# EAGLE schematic Sprite_Sail_1mx1m (EAGLE 9.0.0)
Assembly variants: hdmid
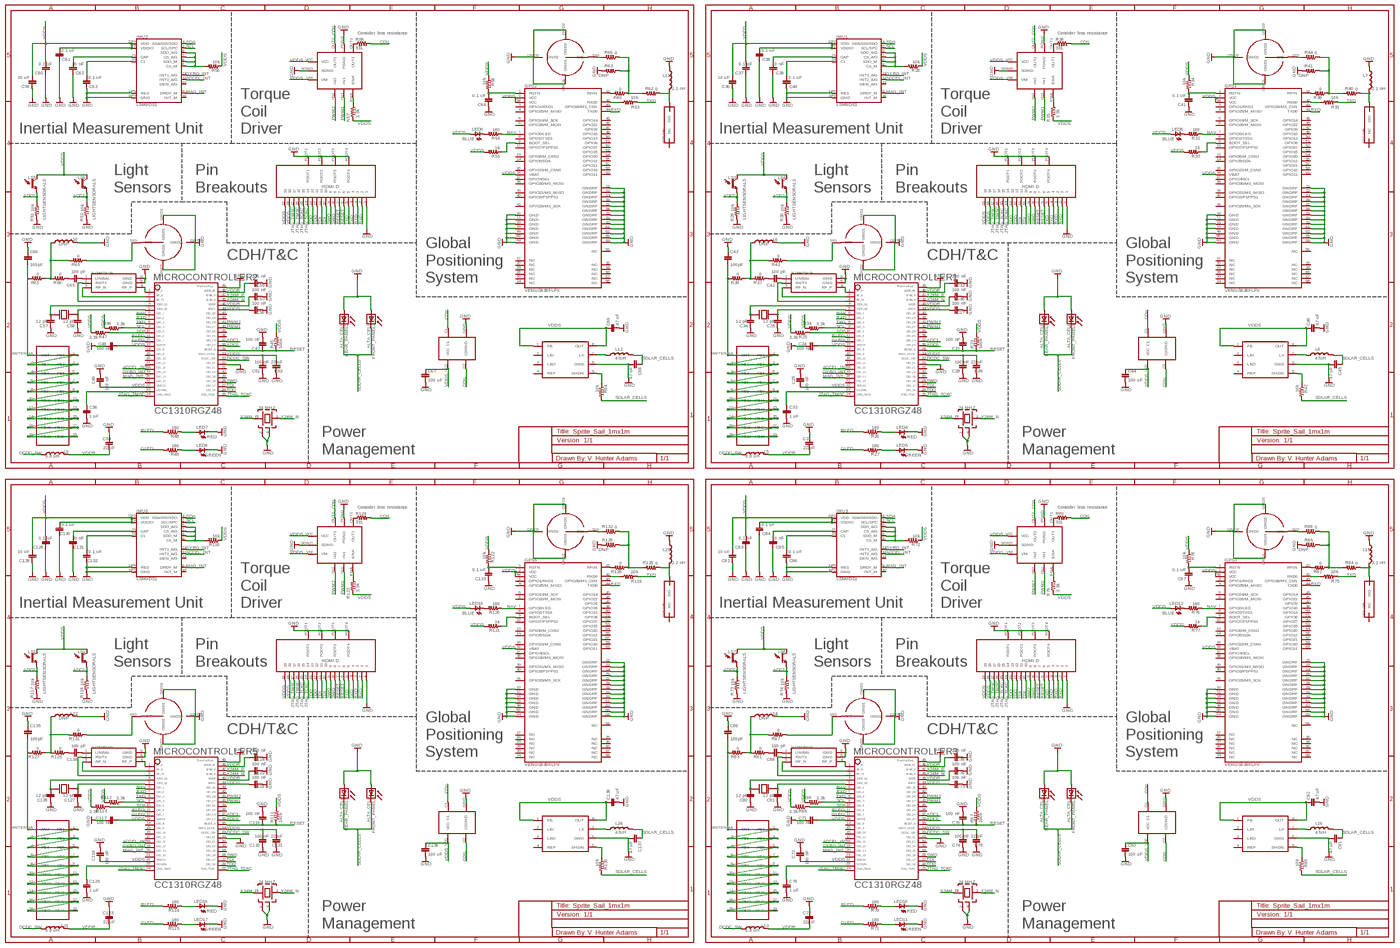
[diagram p0: schematic, sheet 1, overview]
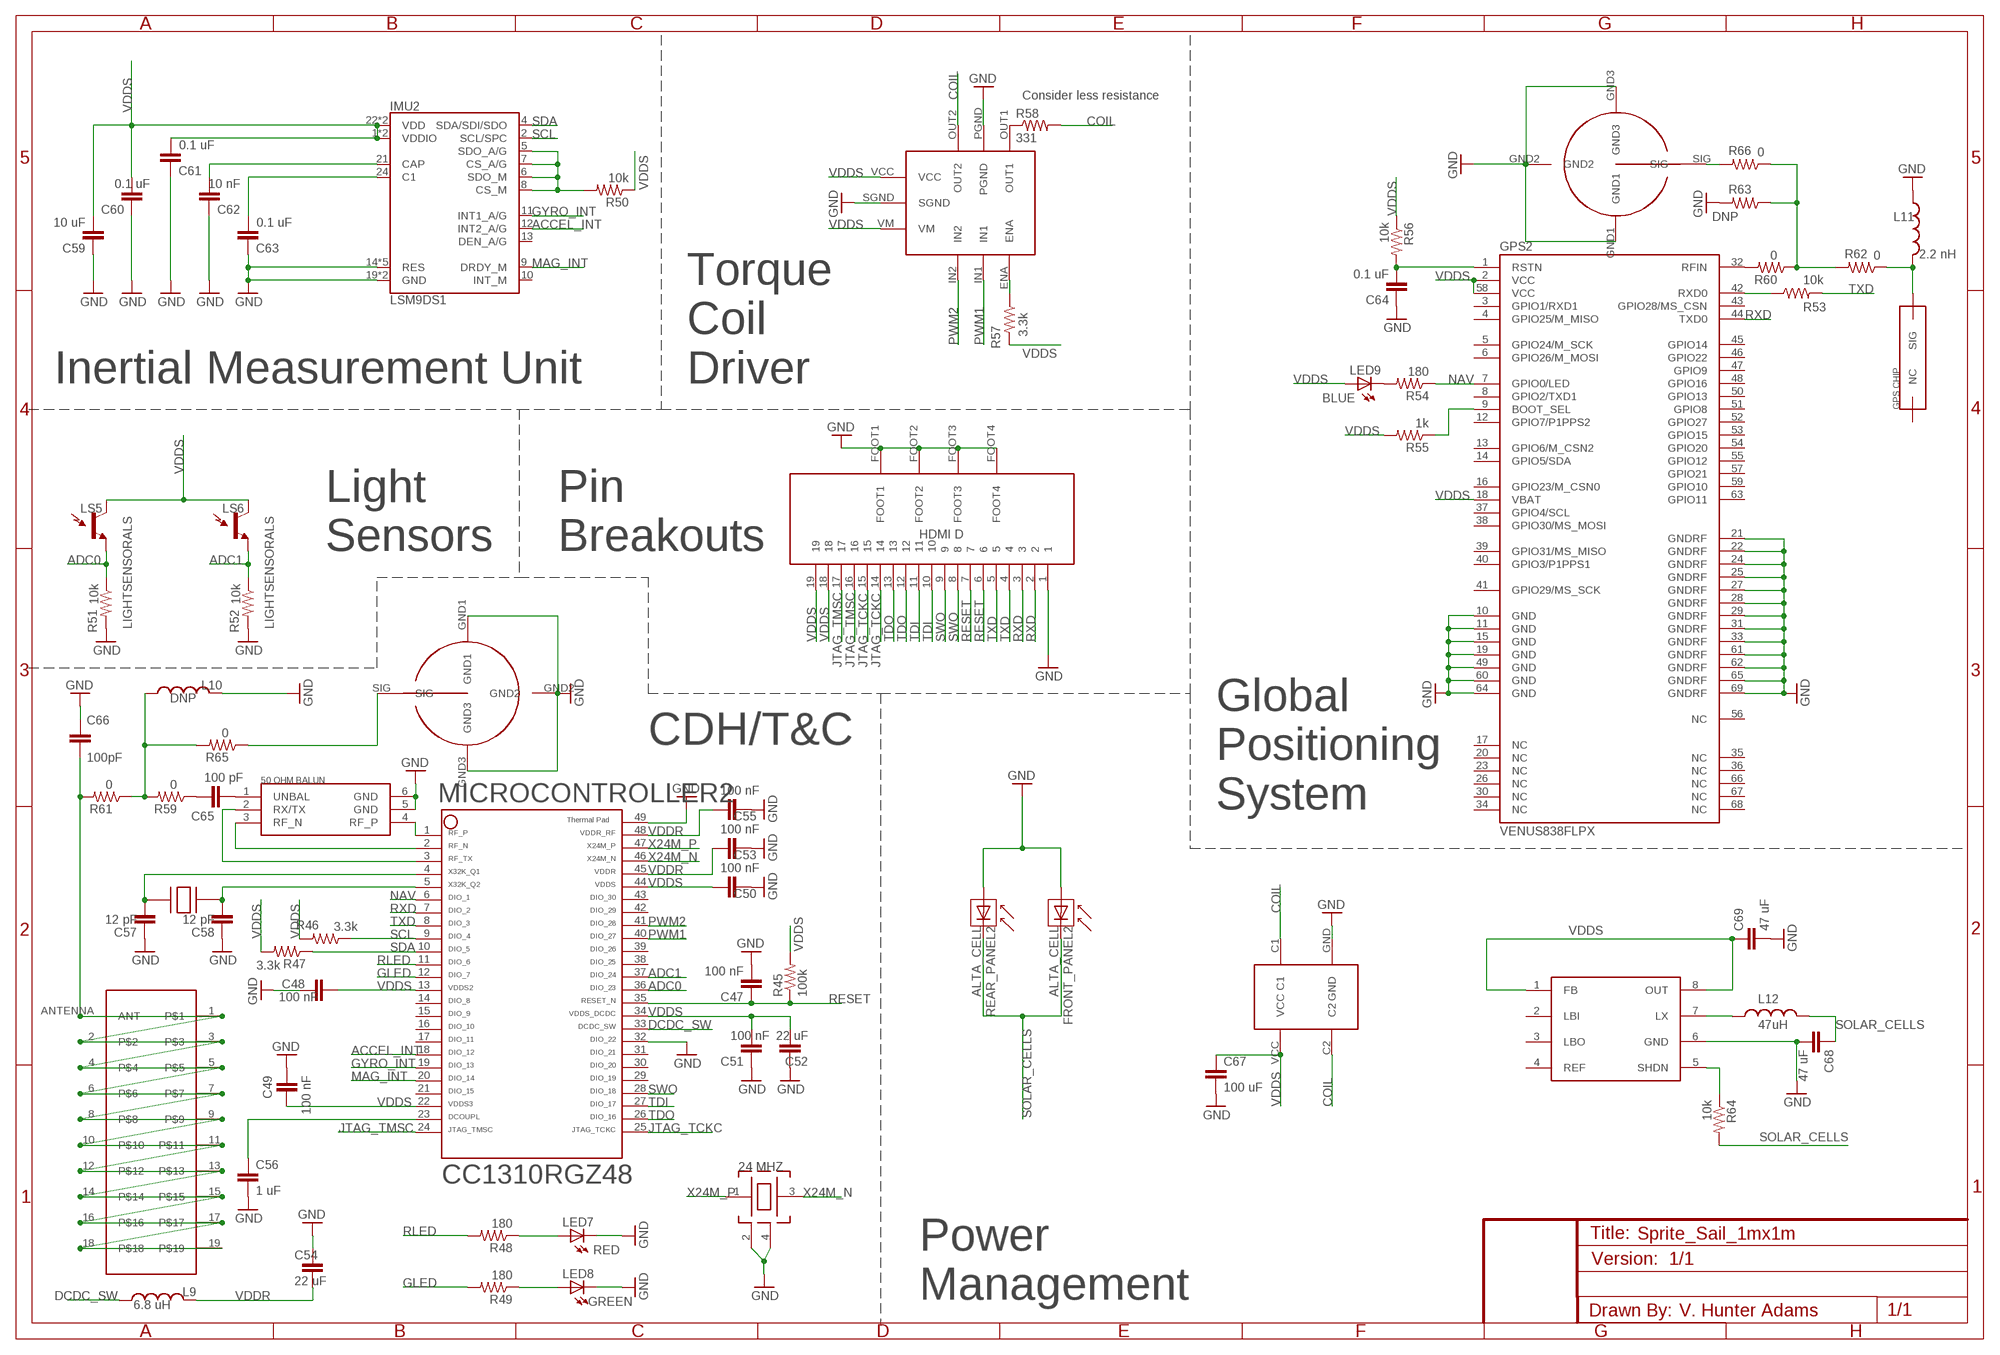
[diagram p1: schematic, sheet 1, part 1 of 4]
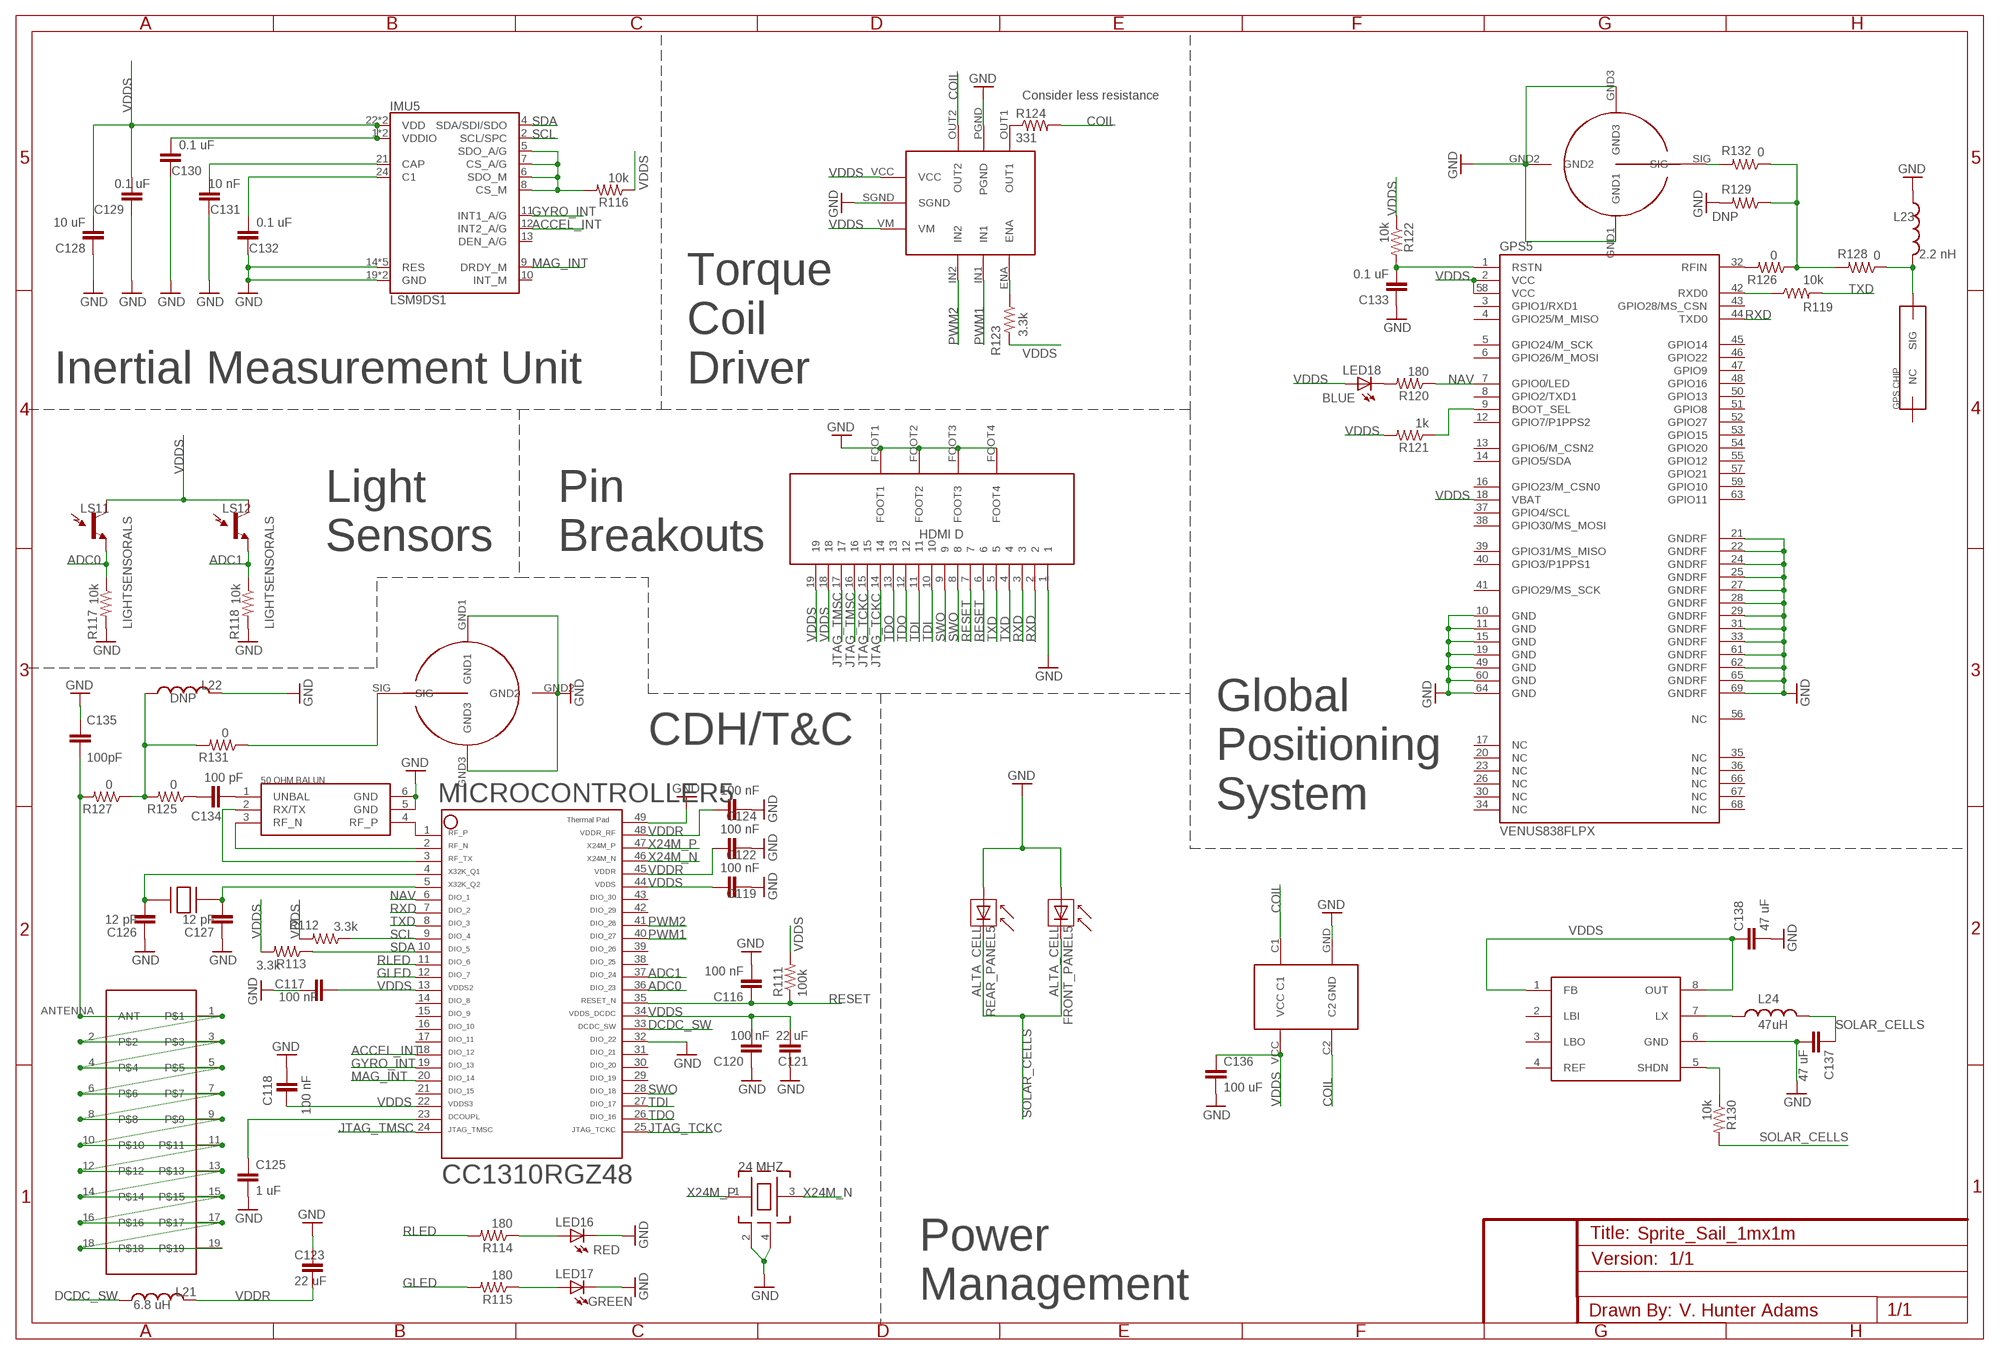
[diagram p2: schematic, sheet 1, part 2 of 4]
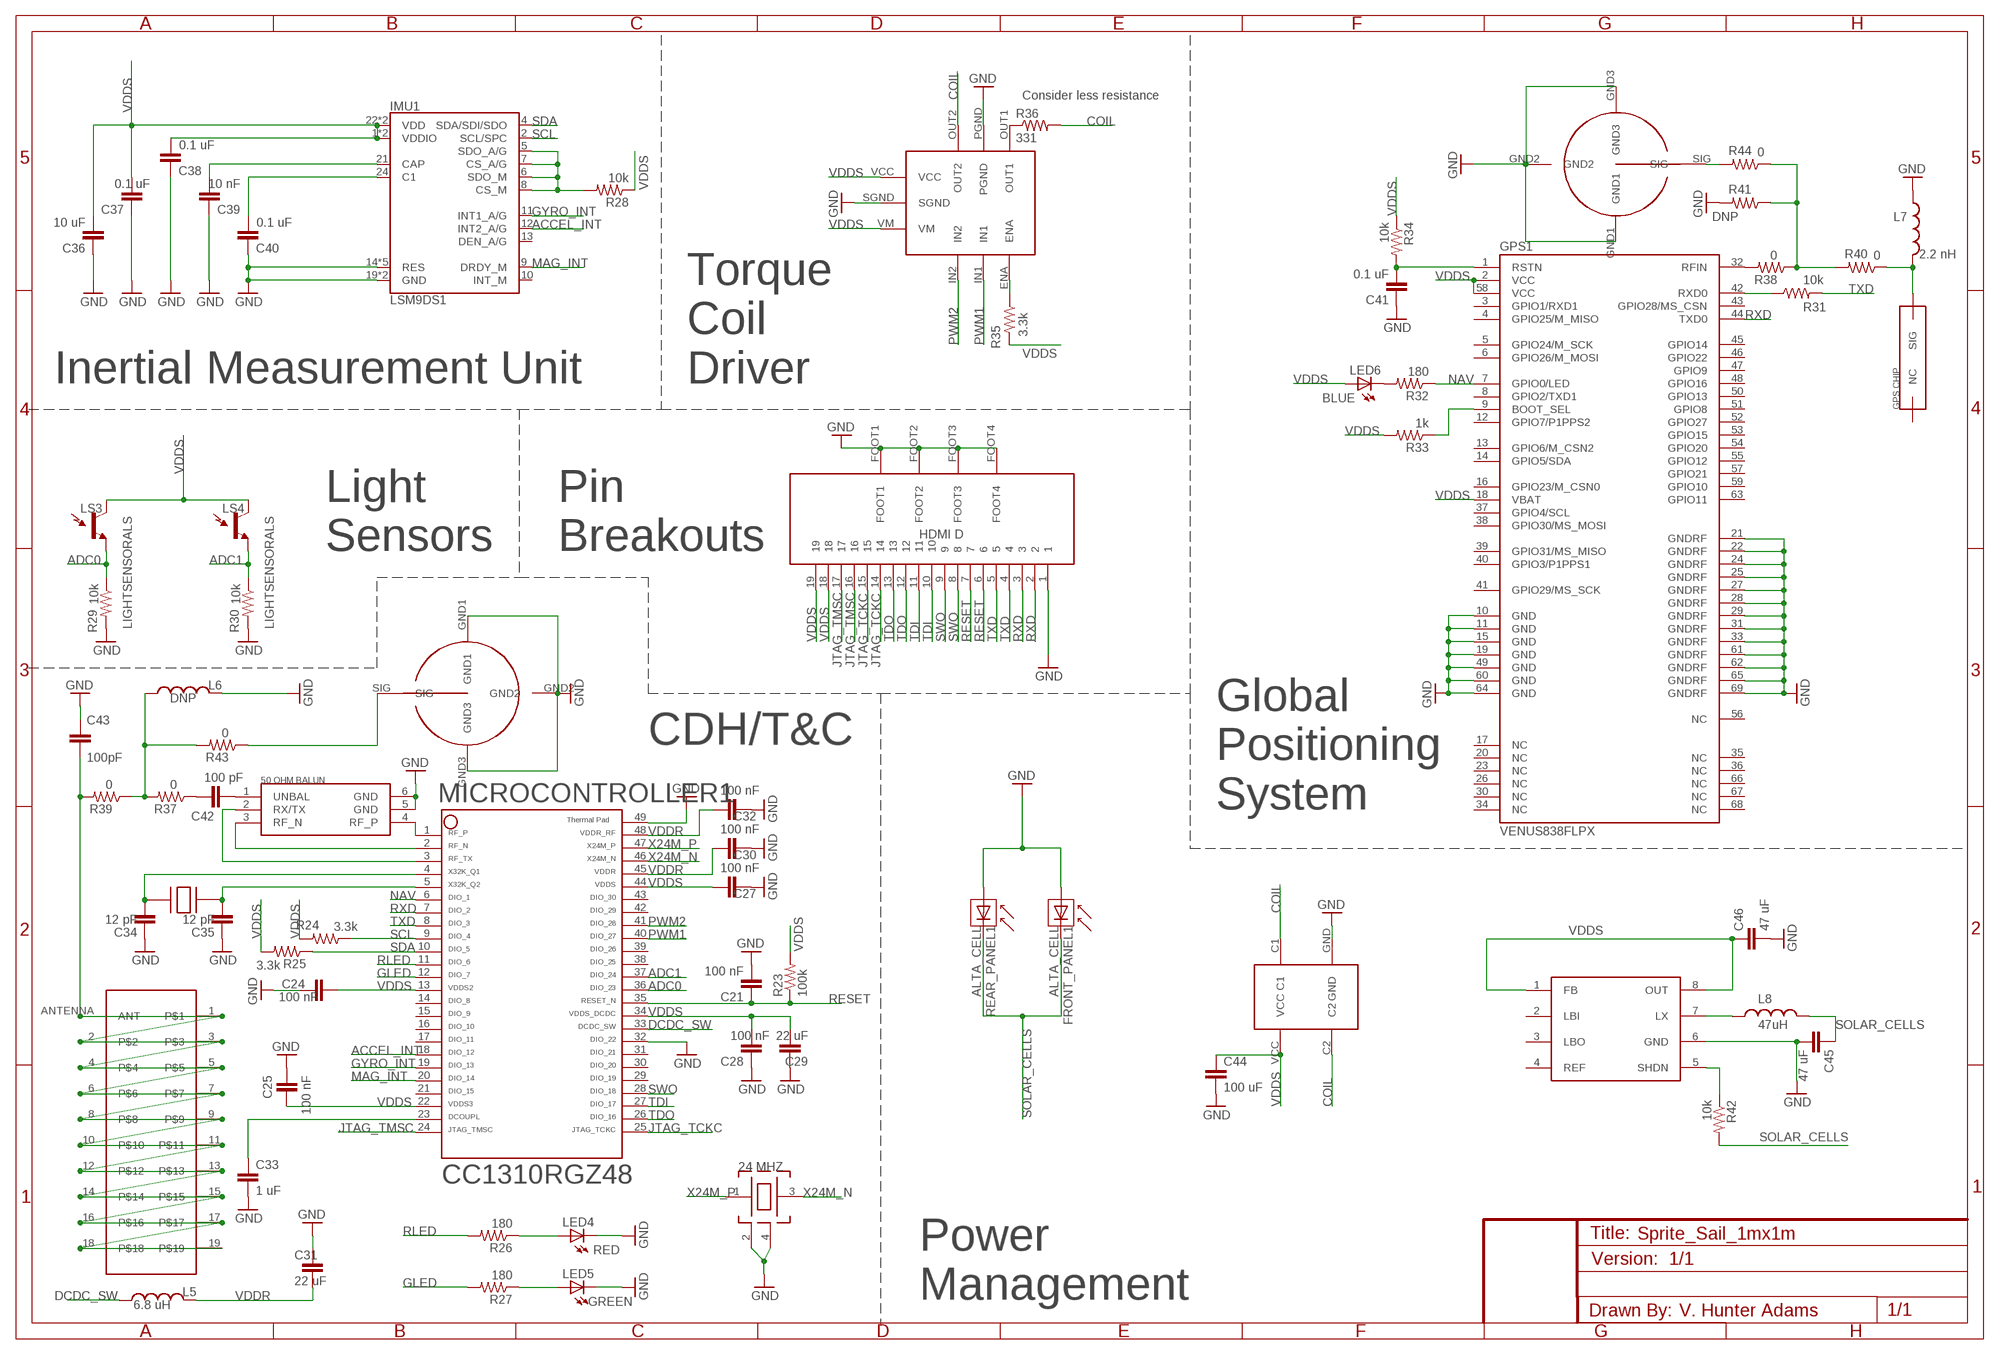
[diagram p3: schematic, sheet 1, part 3 of 4]
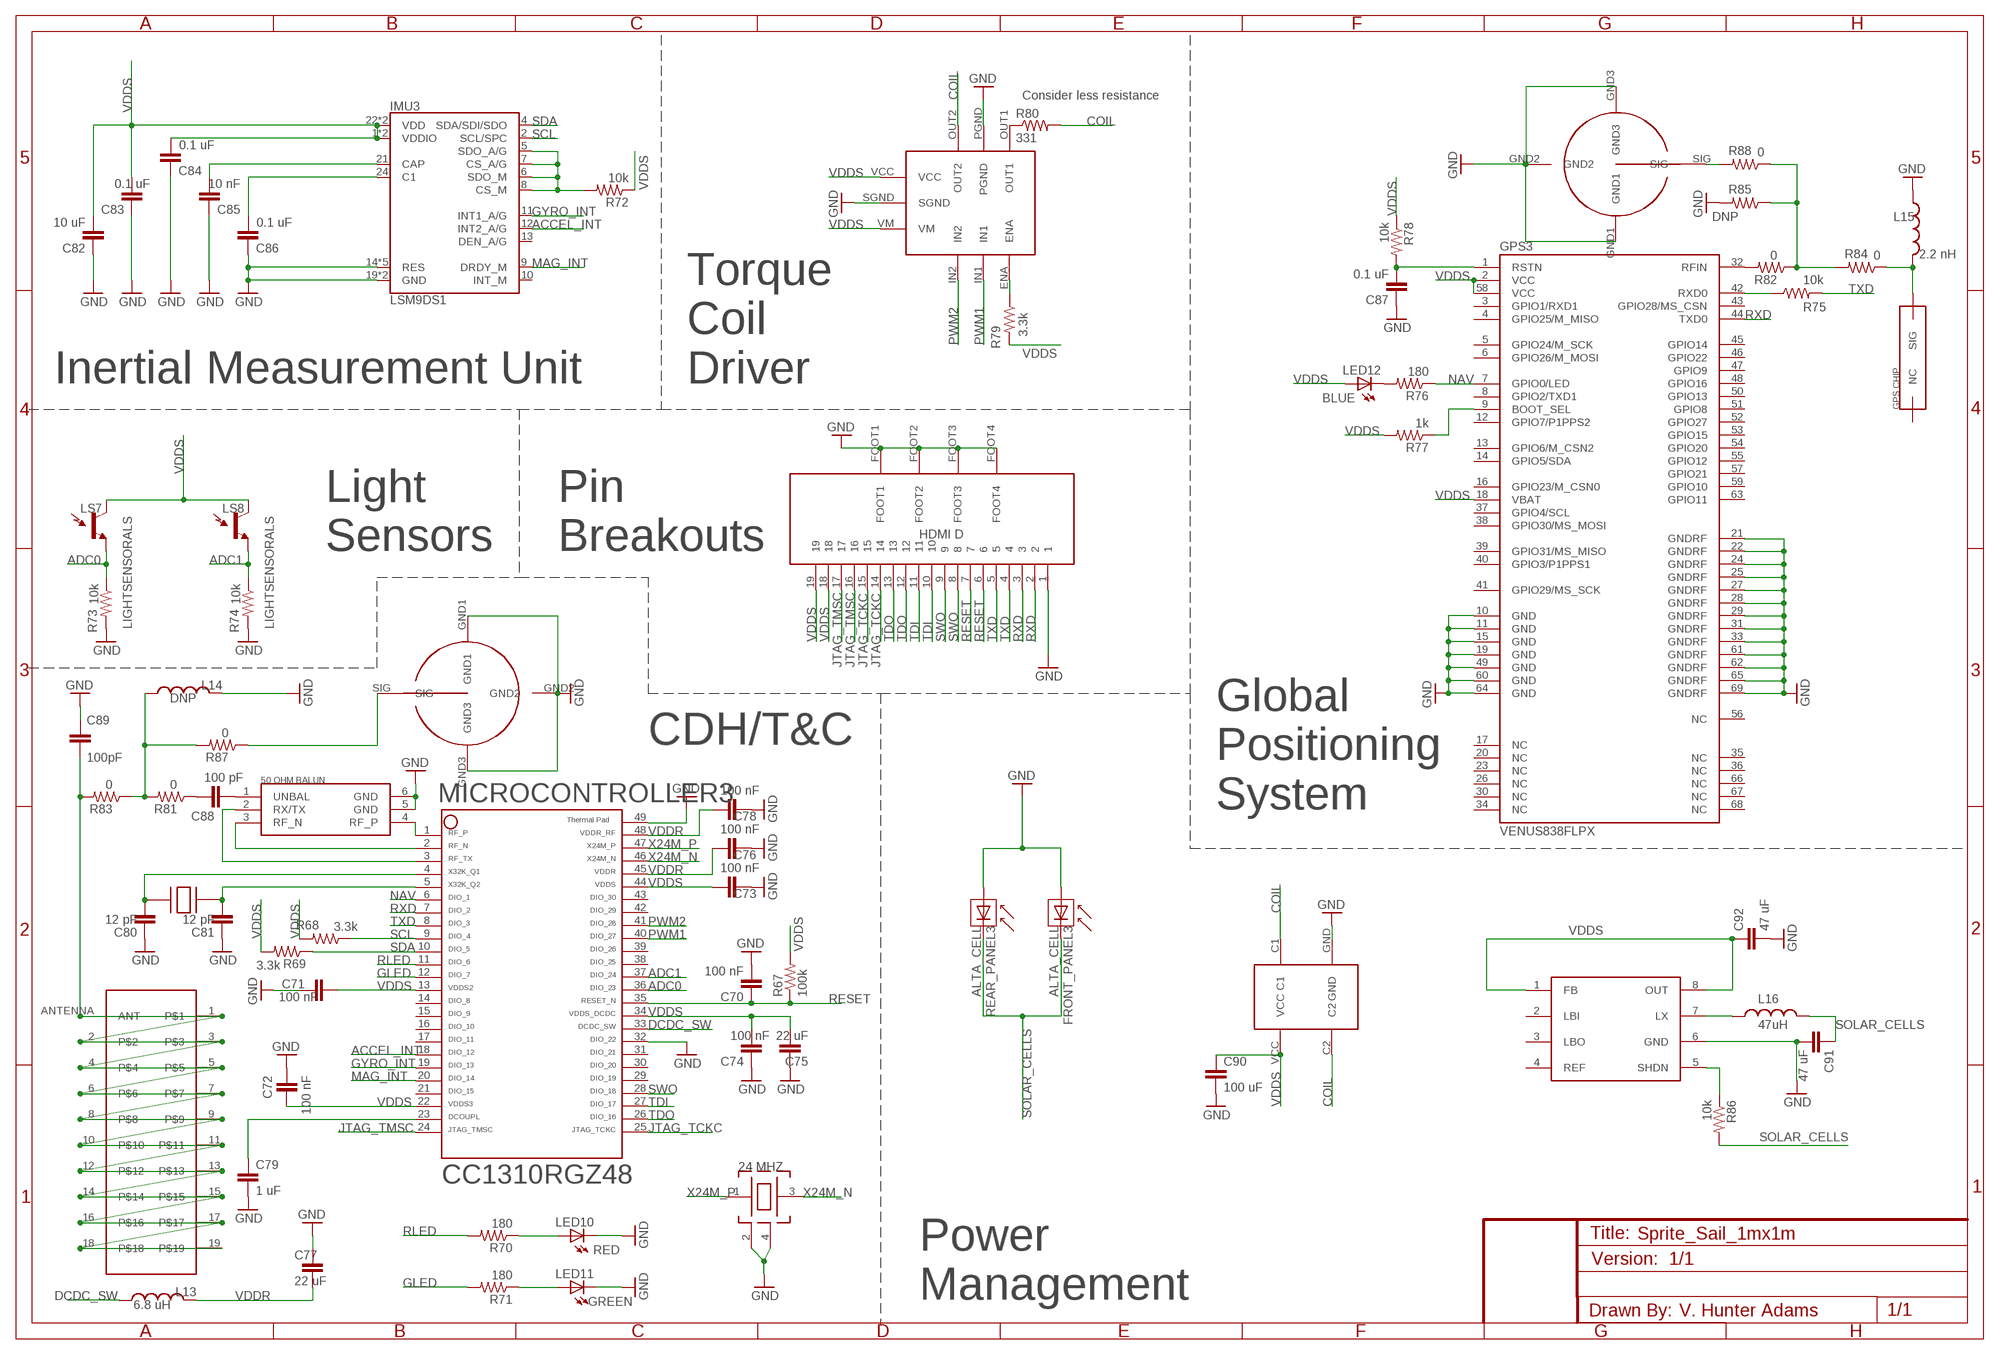
[diagram p4: schematic, sheet 1, part 4 of 4]

## Parts
32.1  FC-135  [FC-135]
32.2  FC-135  [FC-135]
32.3  FC-135  [FC-135]
32.5  FC-135  [FC-135]
BALUN1  JOHANSON_BALUN  [JOHANSON_BALUN]
BALUN2  JOHANSON_BALUN  [JOHANSON_BALUN]
BALUN3  JOHANSON_BALUN  [JOHANSON_BALUN]
BALUN5  JOHANSON_BALUN  [JOHANSON_BALUN]
C21  100 nF  CAP0402-CAP  [0402-CAP]
C24  100 nF  CAP0402-CAP  [0402-CAP]
C25  100 nF  CAP0402-CAP  [0402-CAP]
C27  100 nF  CAP0402-CAP  [0402-CAP]
C28  100 nF  CAP0402-CAP  [0402-CAP]
C29  22 uF  CAP0402-CAP  [0402-CAP]
C30  100 nF  CAP0402-CAP  [0402-CAP]
C31  22 uF  CAP0402-CAP  [0402-CAP]
C32  100 nF  CAP0402-CAP  [0402-CAP]
C33  1 uF  CAP0402-CAP  [0402-CAP]
C34  12 pF  CAP0402-CAP  [0402-CAP]
C35  12 pF  CAP0402-CAP  [0402-CAP]
C36  10 uF  CAP0402-CAP  [0402-CAP]
C37  0.1 uF  CAP0402-CAP  [0402-CAP]
C38  0.1 uF  CAP0402-CAP  [0402-CAP]
C39  10 nF  CAP0402-CAP  [0402-CAP]
C40  0.1 uF  CAP0402-CAP  [0402-CAP]
C41  0.1 uF  CAP0402-CAP  [0402-CAP]
C42  100 pF  CAP0402-CAP  [0402-CAP]
C43  100pF  CAP0603-CAP  [0603-CAP]
C44  100 uF  CAP0805  [0805]
C45  47 uF  CAP0805  [0805]
C46  47 uF  CAP0805  [0805]
C47  100 nF  CAP0402-CAP  [0402-CAP]
C48  100 nF  CAP0402-CAP  [0402-CAP]
C49  100 nF  CAP0402-CAP  [0402-CAP]
C50  100 nF  CAP0402-CAP  [0402-CAP]
C51  100 nF  CAP0402-CAP  [0402-CAP]
C52  22 uF  CAP0402-CAP  [0402-CAP]
C53  100 nF  CAP0402-CAP  [0402-CAP]
C54  22 uF  CAP0402-CAP  [0402-CAP]
C55  100 nF  CAP0402-CAP  [0402-CAP]
C56  1 uF  CAP0402-CAP  [0402-CAP]
C57  12 pF  CAP0402-CAP  [0402-CAP]
C58  12 pF  CAP0402-CAP  [0402-CAP]
C59  10 uF  CAP0402-CAP  [0402-CAP]
C60  0.1 uF  CAP0402-CAP  [0402-CAP]
C61  0.1 uF  CAP0402-CAP  [0402-CAP]
C62  10 nF  CAP0402-CAP  [0402-CAP]
C63  0.1 uF  CAP0402-CAP  [0402-CAP]
C64  0.1 uF  CAP0402-CAP  [0402-CAP]
C65  100 pF  CAP0402-CAP  [0402-CAP]
C66  100pF  CAP0603-CAP  [0603-CAP]
C67  100 uF  CAP0805  [0805]
C68  47 uF  CAP0805  [0805]
C69  47 uF  CAP0805  [0805]
C70  100 nF  CAP0402-CAP  [0402-CAP]
C71  100 nF  CAP0402-CAP  [0402-CAP]
C72  100 nF  CAP0402-CAP  [0402-CAP]
C73  100 nF  CAP0402-CAP  [0402-CAP]
C74  100 nF  CAP0402-CAP  [0402-CAP]
C75  22 uF  CAP0402-CAP  [0402-CAP]
C76  100 nF  CAP0402-CAP  [0402-CAP]
C77  22 uF  CAP0402-CAP  [0402-CAP]
C78  100 nF  CAP0402-CAP  [0402-CAP]
C79  1 uF  CAP0402-CAP  [0402-CAP]
C80  12 pF  CAP0402-CAP  [0402-CAP]
C81  12 pF  CAP0402-CAP  [0402-CAP]
C82  10 uF  CAP0402-CAP  [0402-CAP]
C83  0.1 uF  CAP0402-CAP  [0402-CAP]
C84  0.1 uF  CAP0402-CAP  [0402-CAP]
C85  10 nF  CAP0402-CAP  [0402-CAP]
C86  0.1 uF  CAP0402-CAP  [0402-CAP]
C87  0.1 uF  CAP0402-CAP  [0402-CAP]
C88  100 pF  CAP0402-CAP  [0402-CAP]
C89  100pF  CAP0603-CAP  [0603-CAP]
C90  100 uF  CAP0805  [0805]
C91  47 uF  CAP0805  [0805]
C92  47 uF  CAP0805  [0805]
C116  100 nF  CAP0402-CAP  [0402-CAP]
C117  100 nF  CAP0402-CAP  [0402-CAP]
C118  100 nF  CAP0402-CAP  [0402-CAP]
C119  100 nF  CAP0402-CAP  [0402-CAP]
C120  100 nF  CAP0402-CAP  [0402-CAP]
C121  22 uF  CAP0402-CAP  [0402-CAP]
C122  100 nF  CAP0402-CAP  [0402-CAP]
C123  22 uF  CAP0402-CAP  [0402-CAP]
C124  100 nF  CAP0402-CAP  [0402-CAP]
C125  1 uF  CAP0402-CAP  [0402-CAP]
C126  12 pF  CAP0402-CAP  [0402-CAP]
C127  12 pF  CAP0402-CAP  [0402-CAP]
C128  10 uF  CAP0402-CAP  [0402-CAP]
C129  0.1 uF  CAP0402-CAP  [0402-CAP]
C130  0.1 uF  CAP0402-CAP  [0402-CAP]
C131  10 nF  CAP0402-CAP  [0402-CAP]
C132  0.1 uF  CAP0402-CAP  [0402-CAP]
C133  0.1 uF  CAP0402-CAP  [0402-CAP]
C134  100 pF  CAP0402-CAP  [0402-CAP]
C135  100pF  CAP0603-CAP  [0603-CAP]
C136  100 uF  CAP0805  [0805]
C137  47 uF  CAP0805  [0805]
C138  47 uF  CAP0805  [0805]
FRONT_PANEL1  ALTA_CELL  [ALTA_CELL]
FRONT_PANEL2  ALTA_CELL  [ALTA_CELL]
FRONT_PANEL3  ALTA_CELL  [ALTA_CELL]
FRONT_PANEL5  ALTA_CELL  [ALTA_CELL]
GPS1  VENUS838FLPX  [VENUS838FLPX]
GPS2  VENUS838FLPX  [VENUS838FLPX]
GPS3  VENUS838FLPX  [VENUS838FLPX]
GPS5  VENUS838FLPX  [VENUS838FLPX]
IMU1  LSM9DS1  [LGA24-8X4]
IMU2  LSM9DS1  [LGA24-8X4]
IMU3  LSM9DS1  [LGA24-8X4]
IMU5  LSM9DS1  [LGA24-8X4]
L5  6.8 uH  INDUCTOR0603  [0603]
L6  DNP  INDUCTOR0603  [0603]
L7  2.2 nH  INDUCTOR0603  [0603]
L8  47uH  INDUCTOR0603  [0603]
L9  6.8 uH  INDUCTOR0603  [0603]
L10  DNP  INDUCTOR0603  [0603]
L11  2.2 nH  INDUCTOR0603  [0603]
L12  47uH  INDUCTOR0603  [0603]
L13  6.8 uH  INDUCTOR0603  [0603]
L14  DNP  INDUCTOR0603  [0603]
L15  2.2 nH  INDUCTOR0603  [0603]
L16  47uH  INDUCTOR0603  [0603]
L21  6.8 uH  INDUCTOR0603  [0603]
L22  DNP  INDUCTOR0603  [0603]
L23  2.2 nH  INDUCTOR0603  [0603]
L24  47uH  INDUCTOR0603  [0603]
LED4  RED  LED0603  [LED-0603]
LED5  GREEN  LED0603  [LED-0603]
LED6  BLUE  LED0603  [LED-0603]
LED7  RED  LED0603  [LED-0603]
LED8  GREEN  LED0603  [LED-0603]
LED9  BLUE  LED0603  [LED-0603]
LED10  RED  LED0603  [LED-0603]
LED11  GREEN  LED0603  [LED-0603]
LED12  BLUE  LED0603  [LED-0603]
LED16  RED  LED0603  [LED-0603]
LED17  GREEN  LED0603  [LED-0603]
LED18  BLUE  LED0603  [LED-0603]
LS3  LIGHTSENSORALS  [ALS-PT19]
LS4  LIGHTSENSORALS  [ALS-PT19]
LS5  LIGHTSENSORALS  [ALS-PT19]
LS6  LIGHTSENSORALS  [ALS-PT19]
LS7  LIGHTSENSORALS  [ALS-PT19]
LS8  LIGHTSENSORALS  [ALS-PT19]
LS11  LIGHTSENSORALS  [ALS-PT19]
LS12  LIGHTSENSORALS  [ALS-PT19]
MICROCONTROLLER1  CC1310  [CC1310]
MICROCONTROLLER2  CC1310  [CC1310]
MICROCONTROLLER3  CC1310  [CC1310]
MICROCONTROLLER5  CC1310  [CC1310]
R23  100k  RESISTOR0402-RES  [0402-RES]
R24  3.3k  RESISTOR0402-RES  [0402-RES]
R25  3.3k  RESISTOR0402-RES  [0402-RES]
R26  180  RESISTOR0402-RES  [0402-RES]
R27  180  RESISTOR0402-RES  [0402-RES]
R28  10k  RESISTOR0402-RES  [0402-RES]
R29  10k  RESISTOR0402-RES  [0402-RES]
R30  10k  RESISTOR0402-RES  [0402-RES]
R31  10k  RESISTOR0402-RES  [0402-RES]
R32  180  RESISTOR0402-RES  [0402-RES]
R33  1k  RESISTOR0402-RES  [0402-RES]
R34  10k  RESISTOR0402-RES  [0402-RES]
R35  3.3k  RESISTOR0402-RES  [0402-RES]
R36  331  RESISTOR0402-RES  [0402-RES]
R37  0  RESISTOR0603-RES  [0603-RES]
R38  0  RESISTOR0603-RES  [0603-RES]
R39  0  RESISTOR0603-RES  [0603-RES]
R40  0  RESISTOR0603-RES  [0603-RES]
R41  DNP  RESISTOR0603-RES  [0603-RES]
R42  10k  RESISTOR0402-RES  [0402-RES]
R43  0  RESISTOR0603-RES  [0603-RES]
R44  0  RESISTOR0603-RES  [0603-RES]
R45  100k  RESISTOR0402-RES  [0402-RES]
R46  3.3k  RESISTOR0402-RES  [0402-RES]
R47  3.3k  RESISTOR0402-RES  [0402-RES]
R48  180  RESISTOR0402-RES  [0402-RES]
R49  180  RESISTOR0402-RES  [0402-RES]
R50  10k  RESISTOR0402-RES  [0402-RES]
R51  10k  RESISTOR0402-RES  [0402-RES]
R52  10k  RESISTOR0402-RES  [0402-RES]
R53  10k  RESISTOR0402-RES  [0402-RES]
R54  180  RESISTOR0402-RES  [0402-RES]
R55  1k  RESISTOR0402-RES  [0402-RES]
R56  10k  RESISTOR0402-RES  [0402-RES]
R57  3.3k  RESISTOR0402-RES  [0402-RES]
R58  331  RESISTOR0402-RES  [0402-RES]
R59  0  RESISTOR0603-RES  [0603-RES]
R60  0  RESISTOR0603-RES  [0603-RES]
R61  0  RESISTOR0603-RES  [0603-RES]
R62  0  RESISTOR0603-RES  [0603-RES]
R63  DNP  RESISTOR0603-RES  [0603-RES]
R64  10k  RESISTOR0402-RES  [0402-RES]
R65  0  RESISTOR0603-RES  [0603-RES]
R66  0  RESISTOR0603-RES  [0603-RES]
R67  100k  RESISTOR0402-RES  [0402-RES]
R68  3.3k  RESISTOR0402-RES  [0402-RES]
R69  3.3k  RESISTOR0402-RES  [0402-RES]
R70  180  RESISTOR0402-RES  [0402-RES]
R71  180  RESISTOR0402-RES  [0402-RES]
R72  10k  RESISTOR0402-RES  [0402-RES]
R73  10k  RESISTOR0402-RES  [0402-RES]
R74  10k  RESISTOR0402-RES  [0402-RES]
R75  10k  RESISTOR0402-RES  [0402-RES]
R76  180  RESISTOR0402-RES  [0402-RES]
R77  1k  RESISTOR0402-RES  [0402-RES]
R78  10k  RESISTOR0402-RES  [0402-RES]
R79  3.3k  RESISTOR0402-RES  [0402-RES]
R80  331  RESISTOR0402-RES  [0402-RES]
R81  0  RESISTOR0603-RES  [0603-RES]
R82  0  RESISTOR0603-RES  [0603-RES]
R83  0  RESISTOR0603-RES  [0603-RES]
R84  0  RESISTOR0603-RES  [0603-RES]
R85  DNP  RESISTOR0603-RES  [0603-RES]
R86  10k  RESISTOR0402-RES  [0402-RES]
R87  0  RESISTOR0603-RES  [0603-RES]
R88  0  RESISTOR0603-RES  [0603-RES]
R111  100k  RESISTOR0402-RES  [0402-RES]
R112  3.3k  RESISTOR0402-RES  [0402-RES]
R113  3.3k  RESISTOR0402-RES  [0402-RES]
R114  180  RESISTOR0402-RES  [0402-RES]
R115  180  RESISTOR0402-RES  [0402-RES]
R116  10k  RESISTOR0402-RES  [0402-RES]
R117  10k  RESISTOR0402-RES  [0402-RES]
R118  10k  RESISTOR0402-RES  [0402-RES]
R119  10k  RESISTOR0402-RES  [0402-RES]
R120  180  RESISTOR0402-RES  [0402-RES]
R121  1k  RESISTOR0402-RES  [0402-RES]
R122  10k  RESISTOR0402-RES  [0402-RES]
R123  3.3k  RESISTOR0402-RES  [0402-RES]
R124  331  RESISTOR0402-RES  [0402-RES]
R125  0  RESISTOR0603-RES  [0603-RES]
R126  0  RESISTOR0603-RES  [0603-RES]
R127  0  RESISTOR0603-RES  [0603-RES]
R128  0  RESISTOR0603-RES  [0603-RES]
R129  DNP  RESISTOR0603-RES  [0603-RES]
R130  10k  RESISTOR0402-RES  [0402-RES]
R131  0  RESISTOR0603-RES  [0603-RES]
R132  0  RESISTOR0603-RES  [0603-RES]
REAR_PANEL1  ALTA_CELL  [ALTA_CELL]
REAR_PANEL2  ALTA_CELL  [ALTA_CELL]
REAR_PANEL3  ALTA_CELL  [ALTA_CELL]
REAR_PANEL5  ALTA_CELL  [ALTA_CELL]
TSX1  TSX-3225  [TSX-3225]
TSX2  TSX-3225  [TSX-3225]
TSX3  TSX-3225  [TSX-3225]
TSX5  TSX-3225  [TSX-3225]
U$1  LV8417CS  [LV8417CS]
U$10  JOHANSON_GPS_CHIP  [JOHANSON_GPS_CHIP]
U$11  PANASONIC_RECTIFIER  [PANASONIC_RECTIFIER]
U$12  PCB_ANTENNA  [PCB_ANTENNA]
U$13  MM5329-2700  [MM5829-2700]
U$14  MM5329-2700  [MM5829-2700]
U$15  L6920  [L6920]
U$16  HDMID  [HDMID]
U$17  LV8417CS  [LV8417CS]
U$18  JOHANSON_GPS_CHIP  [JOHANSON_GPS_CHIP]
U$19  PANASONIC_RECTIFIER  [PANASONIC_RECTIFIER]
U$20  PCB_ANTENNA  [PCB_ANTENNA]
U$21  MM5329-2700  [MM5829-2700]
U$22  MM5329-2700  [MM5829-2700]
U$23  L6920  [L6920]
U$24  HDMID  [HDMID]
U$25  LV8417CS  [LV8417CS]
U$26  JOHANSON_GPS_CHIP  [JOHANSON_GPS_CHIP]
U$27  PANASONIC_RECTIFIER  [PANASONIC_RECTIFIER]
U$28  PCB_ANTENNA  [PCB_ANTENNA]
U$29  MM5329-2700  [MM5829-2700]
U$30  MM5329-2700  [MM5829-2700]
U$31  L6920  [L6920]
U$32  HDMID  [HDMID]
U$41  LV8417CS  [LV8417CS]
U$42  JOHANSON_GPS_CHIP  [JOHANSON_GPS_CHIP]
U$43  PANASONIC_RECTIFIER  [PANASONIC_RECTIFIER]
U$44  PCB_ANTENNA  [PCB_ANTENNA]
U$45  MM5329-2700  [MM5829-2700]
U$46  MM5329-2700  [MM5829-2700]
U$47  L6920  [L6920]
U$48  HDMID  [HDMID]

## Nets
ACCEL_INT: IMU1.12(INT2_A/G) IMU2.12(INT2_A/G) IMU3.12(INT2_A/G) IMU5.12(INT2_A/G) MICROCONTROLLER1.18 MICROCONTROLLER2.18 MICROCONTROLLER3.18 MICROCONTROLLER5.18
ADC0: LS3.E(E1) LS5.E(E1) LS7.E(E1) LS11.E(E1) MICROCONTROLLER1.36 MICROCONTROLLER2.36 MICROCONTROLLER3.36 MICROCONTROLLER5.36 R29.1 R51.1 R73.1 R117.1
ADC1: LS4.E(E1) LS6.E(E1) LS8.E(E1) LS12.E(E1) MICROCONTROLLER1.37 MICROCONTROLLER2.37 MICROCONTROLLER3.37 MICROCONTROLLER5.37 R30.1 R52.1 R74.1 R118.1
ANTENNA1: C43.2 R39.2 U$12.1 U$12.2 U$12.3 U$12.4 U$12.5 U$12.6 U$12.7 U$12.8 U$12.9 U$12.10 U$12.11 U$12.12 U$12.13 U$12.14 U$12.15 U$12.16 U$12.17 U$12.18 U$12.19 U$12.ANTENNA(ANT)
ANTENNA2: C66.2 R61.2 U$20.1 U$20.2 U$20.3 U$20.4 U$20.5 U$20.6 U$20.7 U$20.8 U$20.9 U$20.10 U$20.11 U$20.12 U$20.13 U$20.14 U$20.15 U$20.16 U$20.17 U$20.18 U$20.19 U$20.ANTENNA(ANT)
ANTENNA3: C89.2 R83.2 U$28.1 U$28.2 U$28.3 U$28.4 U$28.5 U$28.6 U$28.7 U$28.8 U$28.9 U$28.10 U$28.11 U$28.12 U$28.13 U$28.14 U$28.15 U$28.16 U$28.17 U$28.18 U$28.19 U$28.ANTENNA(ANT)
ANTENNA5: C135.2 R127.2 U$44.1 U$44.2 U$44.3 U$44.4 U$44.5 U$44.6 U$44.7 U$44.8 U$44.9 U$44.10 U$44.11 U$44.12 U$44.13 U$44.14 U$44.15 U$44.16 U$44.17 U$44.18 U$44.19 U$44.ANTENNA(ANT)
COIL: R36.2 R58.2 R80.2 R124.2 U$1.OUT2 U$11.C1 U$11.C2 U$17.OUT2 U$19.C1 U$19.C2 U$25.OUT2 U$27.C1 U$27.C2 U$41.OUT2 U$43.C1 U$43.C2
DCDC_SW: L5.1 L9.1 L13.1 L21.1 MICROCONTROLLER1.33 MICROCONTROLLER2.33 MICROCONTROLLER3.33 MICROCONTROLLER5.33
GLED: MICROCONTROLLER1.12 MICROCONTROLLER2.12 MICROCONTROLLER3.12 MICROCONTROLLER5.12 R27.2 R49.2 R71.2 R115.2
GND: BALUN1.5(GND) BALUN1.6(GND) BALUN2.5(GND) BALUN2.6(GND) BALUN3.5(GND) BALUN3.6(GND) BALUN5.5(GND) BALUN5.6(GND) C21.2 C24.2 C25.2 C27.2 C28.2 C29.2 C30.2 C31.2 C32.2 C33.2 C34.2 C35.2 C36.2 C37.2 C38.2 C39.2 C40.2 C41.2 C43.1 C44.2 C45.2 C46.2 C47.2 C48.2 C49.2 C50.2 C51.2 C52.2 C53.2 C54.2 C55.2 C56.2 C57.2 C58.2 C59.2 C60.2 C61.2 C62.2 C63.2 C64.2 C66.1 C67.2 C68.2 C69.2 C70.2 C71.2 C72.2 C73.2 C74.2 C75.2 C76.2 C77.2 C78.2 C79.2 C80.2 C81.2 C82.2 C83.2 C84.2 C85.2 C86.2 C87.2 C89.1 C90.2 C91.2 C92.2 C116.2 C117.2 C118.2 C119.2 C120.2 C121.2 C122.2 C123.2 C124.2 C125.2 C126.2 C127.2 C128.2 C129.2 C130.2 C131.2 C132.2 C133.2 C135.1 C136.2 C137.2 C138.2 FRONT_PANEL1.- FRONT_PANEL2.- FRONT_PANEL3.- FRONT_PANEL5.- GPS1.10(GND) GPS1.11(GND) GPS1.15(GND) GPS1.19(GND) GPS1.21(GNDRF) GPS1.22(GNDRF) GPS1.24(GNDRF) GPS1.25(GNDRF) GPS1.27(GNDRF) GPS1.28(GNDRF) GPS1.29(GNDRF) GPS1.31(GNDRF) GPS1.33(GNDRF) GPS1.49(GND) GPS1.60(GND) GPS1.61(GNDRF) GPS1.62(GNDRF) GPS1.64(GND) GPS1.65(GNDRF) GPS1.69(GNDRF) GPS2.10(GND) GPS2.11(GND) GPS2.15(GND) GPS2.19(GND) GPS2.21(GNDRF) GPS2.22(GNDRF) GPS2.24(GNDRF) GPS2.25(GNDRF) GPS2.27(GNDRF) GPS2.28(GNDRF) GPS2.29(GNDRF) GPS2.31(GNDRF) GPS2.33(GNDRF) GPS2.49(GND) GPS2.60(GND) GPS2.61(GNDRF) GPS2.62(GNDRF) GPS2.64(GND) GPS2.65(GNDRF) GPS2.69(GNDRF) GPS3.10(GND) GPS3.11(GND) GPS3.15(GND) GPS3.19(GND) GPS3.21(GNDRF) GPS3.22(GNDRF) GPS3.24(GNDRF) GPS3.25(GNDRF) GPS3.27(GNDRF) GPS3.28(GNDRF) GPS3.29(GNDRF) GPS3.31(GNDRF) GPS3.33(GNDRF) GPS3.49(GND) GPS3.60(GND) GPS3.61(GNDRF) GPS3.62(GNDRF) GPS3.64(GND) GPS3.65(GNDRF) GPS3.69(GNDRF) GPS5.10(GND) GPS5.11(GND) GPS5.15(GND) GPS5.19(GND) GPS5.21(GNDRF) GPS5.22(GNDRF) GPS5.24(GNDRF) GPS5.25(GNDRF) GPS5.27(GNDRF) GPS5.28(GNDRF) GPS5.29(GNDRF) GPS5.31(GNDRF) GPS5.33(GNDRF) GPS5.49(GND) GPS5.60(GND) GPS5.61(GNDRF) GPS5.62(GNDRF) GPS5.64(GND) GPS5.65(GNDRF) GPS5.69(GNDRF) IMU1.14(RES) IMU1.15(RES) IMU1.16(RES) IMU1.17(RES) IMU1.18(RES) IMU1.19(GND) IMU1.20(GND) IMU2.14(RES) IMU2.15(RES) IMU2.16(RES) IMU2.17(RES) IMU2.18(RES) IMU2.19(GND) IMU2.20(GND) IMU3.14(RES) IMU3.15(RES) IMU3.16(RES) IMU3.17(RES) IMU3.18(RES) IMU3.19(GND) IMU3.20(GND) IMU5.14(RES) IMU5.15(RES) IMU5.16(RES) IMU5.17(RES) IMU5.18(RES) IMU5.19(GND) IMU5.20(GND) L6.2 L7.1 L10.2 L11.1 L14.2 L15.1 L22.2 L23.1 LED4.C LED5.C LED7.C LED8.C LED10.C LED11.C LED16.C LED17.C MICROCONTROLLER1.32 MICROCONTROLLER1.49 MICROCONTROLLER2.32 MICROCONTROLLER2.49 MICROCONTROLLER3.32 MICROCONTROLLER3.49 MICROCONTROLLER5.32 MICROCONTROLLER5.49 R29.2 R30.2 R41.2 R51.2 R52.2 R63.2 R73.2 R74.2 R85.2 R117.2 R118.2 R129.2 REAR_PANEL1.- REAR_PANEL2.- REAR_PANEL3.- REAR_PANEL5.- TSX1.2 TSX1.4 TSX2.2 TSX2.4 TSX3.2 TSX3.4 TSX5.2 TSX5.4 U$1.PGND U$1.SGND U$11.GND U$13.GND1 U$13.GND2 U$13.GND3 U$14.GND1 U$14.GND2 U$14.GND3 U$15.6(GND) U$16.1 U$16.FOOT1 U$16.FOOT2 U$16.FOOT3 U$16.FOOT4 U$17.PGND U$17.SGND U$19.GND U$21.GND1 U$21.GND2 U$21.GND3 U$22.GND1 U$22.GND2 U$22.GND3 U$23.6(GND) U$24.1 U$24.FOOT1 U$24.FOOT2 U$24.FOOT3 U$24.FOOT4 U$25.PGND U$25.SGND U$27.GND U$29.GND1 U$29.GND2 U$29.GND3 U$30.GND1 U$30.GND2 U$30.GND3 U$31.6(GND) U$32.1 U$32.FOOT1 U$32.FOOT2 U$32.FOOT3 U$32.FOOT4 U$41.PGND U$41.SGND U$43.GND U$45.GND1 U$45.GND2 U$45.GND3 U$46.GND1 U$46.GND2 U$46.GND3 U$47.6(GND) U$48.1 U$48.FOOT1 U$48.FOOT2 U$48.FOOT3 U$48.FOOT4
GYRO_INT: IMU1.11(INT1_A/G) IMU2.11(INT1_A/G) IMU3.11(INT1_A/G) IMU5.11(INT1_A/G) MICROCONTROLLER1.19 MICROCONTROLLER2.19 MICROCONTROLLER3.19 MICROCONTROLLER5.19
JTAG_TCKC: MICROCONTROLLER1.25 MICROCONTROLLER2.25 MICROCONTROLLER3.25 MICROCONTROLLER5.25 U$16.14 U$16.15 U$24.14 U$24.15 U$32.14 U$32.15 U$48.14 U$48.15
JTAG_TMSC: MICROCONTROLLER1.24 MICROCONTROLLER2.24 MICROCONTROLLER3.24 MICROCONTROLLER5.24 U$16.16 U$16.17 U$24.16 U$24.17 U$32.16 U$32.17 U$48.16 U$48.17
MAG_INT: IMU1.9(DRDY_M) IMU2.9(DRDY_M) IMU3.9(DRDY_M) IMU5.9(DRDY_M) MICROCONTROLLER1.20 MICROCONTROLLER2.20 MICROCONTROLLER3.20 MICROCONTROLLER5.20
N$49: C33.1 MICROCONTROLLER1.23
N$50: 32.1.P2 C34.1 MICROCONTROLLER1.4
N$51: 32.1.P1 C35.1 MICROCONTROLLER1.5
N$52: LED4.A R26.1
N$53: LED5.A R27.1
N$54: C39.1 IMU1.21(CAP)
N$55: C40.1 IMU1.24(C1)
N$56: IMU1.5(SDO_A/G) IMU1.6(SDO_M) IMU1.7(CS_A/G) IMU1.8(CS_M) R28.2
N$57: GPS1.42(RXD0) R31.1
N$58: LED6.C R32.2
N$59: GPS1.9(BOOT_SEL) R33.1
N$60: C41.1 GPS1.1(RSTN) R34.2
N$61: R35.1 U$1.ENA
N$62: R36.1 U$1.OUT1
N$63: BALUN1.4(RF_P) MICROCONTROLLER1.1
N$64: BALUN1.3(RF_N) MICROCONTROLLER1.2
N$65: BALUN1.2(RX/TX) MICROCONTROLLER1.3
N$66: BALUN1.1(UNBAL) C42.2
N$67: L6.1 R37.2 R39.1 R43.2
N$68: C42.1 R37.1
N$69: GPS1.32(RFIN) R38.2
N$70: R38.1 R40.2 R41.1 R44.1
N$71: L7.2 R40.1 U$10.SIG
N$72: R42.1 U$15.5(SHDN)
N$73: L8.1 U$15.7(LX)
N$74: R44.2 U$14.SIG
N$75: R43.1 U$13.SIG
N$97: C56.1 MICROCONTROLLER2.23
N$98: 32.2.P2 C57.1 MICROCONTROLLER2.4
N$99: 32.2.P1 C58.1 MICROCONTROLLER2.5
N$100: LED7.A R48.1
N$101: LED8.A R49.1
N$102: C62.1 IMU2.21(CAP)
N$103: C63.1 IMU2.24(C1)
N$104: IMU2.5(SDO_A/G) IMU2.6(SDO_M) IMU2.7(CS_A/G) IMU2.8(CS_M) R50.2
N$105: GPS2.42(RXD0) R53.1
N$106: LED9.C R54.2
N$107: GPS2.9(BOOT_SEL) R55.1
N$108: C64.1 GPS2.1(RSTN) R56.2
N$109: R57.1 U$17.ENA
N$110: R58.1 U$17.OUT1
N$111: BALUN2.4(RF_P) MICROCONTROLLER2.1
N$112: BALUN2.3(RF_N) MICROCONTROLLER2.2
N$113: BALUN2.2(RX/TX) MICROCONTROLLER2.3
N$114: BALUN2.1(UNBAL) C65.2
N$115: L10.1 R59.2 R61.1 R65.2
N$116: C65.1 R59.1
N$117: GPS2.32(RFIN) R60.2
N$118: R60.1 R62.2 R63.1 R66.1
N$119: L11.2 R62.1 U$18.SIG
N$120: R64.1 U$23.5(SHDN)
N$121: L12.1 U$23.7(LX)
N$122: R66.2 U$22.SIG
N$123: R65.1 U$21.SIG
N$145: C79.1 MICROCONTROLLER3.23
N$146: 32.3.P2 C80.1 MICROCONTROLLER3.4
N$147: 32.3.P1 C81.1 MICROCONTROLLER3.5
N$148: LED10.A R70.1
N$149: LED11.A R71.1
N$150: C85.1 IMU3.21(CAP)
N$151: C86.1 IMU3.24(C1)
N$152: IMU3.5(SDO_A/G) IMU3.6(SDO_M) IMU3.7(CS_A/G) IMU3.8(CS_M) R72.2
N$153: GPS3.42(RXD0) R75.1
N$154: LED12.C R76.2
N$155: GPS3.9(BOOT_SEL) R77.1
N$156: C87.1 GPS3.1(RSTN) R78.2
N$157: R79.1 U$25.ENA
N$158: R80.1 U$25.OUT1
N$159: BALUN3.4(RF_P) MICROCONTROLLER3.1
N$160: BALUN3.3(RF_N) MICROCONTROLLER3.2
N$161: BALUN3.2(RX/TX) MICROCONTROLLER3.3
N$162: BALUN3.1(UNBAL) C88.2
N$163: L14.1 R81.2 R83.1 R87.2
N$164: C88.1 R81.1
N$165: GPS3.32(RFIN) R82.2
N$166: R82.1 R84.2 R85.1 R88.1
N$167: L15.2 R84.1 U$26.SIG
N$168: R86.1 U$31.5(SHDN)
N$169: L16.1 U$31.7(LX)
N$170: R88.2 U$30.SIG
N$171: R87.1 U$29.SIG
N$241: C125.1 MICROCONTROLLER5.23
N$242: 32.5.P2 C126.1 MICROCONTROLLER5.4
N$243: 32.5.P1 C127.1 MICROCONTROLLER5.5
N$244: LED16.A R114.1
N$245: LED17.A R115.1
N$246: C131.1 IMU5.21(CAP)
N$247: C132.1 IMU5.24(C1)
N$248: IMU5.5(SDO_A/G) IMU5.6(SDO_M) IMU5.7(CS_A/G) IMU5.8(CS_M) R116.2
N$249: GPS5.42(RXD0) R119.1
N$250: LED18.C R120.2
N$251: GPS5.9(BOOT_SEL) R121.1
N$252: C133.1 GPS5.1(RSTN) R122.2
N$253: R123.1 U$41.ENA
N$254: R124.1 U$41.OUT1
N$255: BALUN5.4(RF_P) MICROCONTROLLER5.1
N$256: BALUN5.3(RF_N) MICROCONTROLLER5.2
N$257: BALUN5.2(RX/TX) MICROCONTROLLER5.3
N$258: BALUN5.1(UNBAL) C134.2
N$259: L22.1 R125.2 R127.1 R131.2
N$260: C134.1 R125.1
N$261: GPS5.32(RFIN) R126.2
N$262: R126.1 R128.2 R129.1 R132.1
N$263: L23.2 R128.1 U$42.SIG
N$264: R130.1 U$47.5(SHDN)
N$265: L24.1 U$47.7(LX)
N$266: R132.2 U$46.SIG
N$267: R131.1 U$45.SIG
NAV: GPS1.7(GPIO0/LED) GPS2.7(GPIO0/LED) GPS3.7(GPIO0/LED) GPS5.7(GPIO0/LED) MICROCONTROLLER1.6 MICROCONTROLLER2.6 MICROCONTROLLER3.6 MICROCONTROLLER5.6 R32.1 R54.1 R76.1 R120.1
PWM1: MICROCONTROLLER1.40 MICROCONTROLLER2.40 MICROCONTROLLER3.40 MICROCONTROLLER5.40 U$1.IN1 U$17.IN1 U$25.IN1 U$41.IN1
PWM2: MICROCONTROLLER1.41 MICROCONTROLLER2.41 MICROCONTROLLER3.41 MICROCONTROLLER5.41 U$1.IN2 U$17.IN2 U$25.IN2 U$41.IN2
RESET: C21.1 C47.1 C70.1 C116.1 MICROCONTROLLER1.35 MICROCONTROLLER2.35 MICROCONTROLLER3.35 MICROCONTROLLER5.35 R23.1 R45.1 R67.1 R111.1 U$16.6 U$16.7 U$24.6 U$24.7 U$32.6 U$32.7 U$48.6 U$48.7
RLED: MICROCONTROLLER1.11 MICROCONTROLLER2.11 MICROCONTROLLER3.11 MICROCONTROLLER5.11 R26.2 R48.2 R70.2 R114.2
RXD: GPS1.44(TXD0) GPS2.44(TXD0) GPS3.44(TXD0) GPS5.44(TXD0) MICROCONTROLLER1.7 MICROCONTROLLER2.7 MICROCONTROLLER3.7 MICROCONTROLLER5.7 U$16.2 U$16.3 U$24.2 U$24.3 U$32.2 U$32.3 U$48.2 U$48.3
SCL: IMU1.2(SCL/SPC) IMU2.2(SCL/SPC) IMU3.2(SCL/SPC) IMU5.2(SCL/SPC) MICROCONTROLLER1.9 MICROCONTROLLER2.9 MICROCONTROLLER3.9 MICROCONTROLLER5.9 R24.1 R46.1 R68.1 R112.1
SDA: IMU1.4(SDA/SDI/SDO) IMU2.4(SDA/SDI/SDO) IMU3.4(SDA/SDI/SDO) IMU5.4(SDA/SDI/SDO) MICROCONTROLLER1.10 MICROCONTROLLER2.10 MICROCONTROLLER3.10 MICROCONTROLLER5.10 R25.1 R47.1 R69.1 R113.1
SOLAR_CELLS: C45.1 C68.1 C91.1 C137.1 FRONT_PANEL1.+ FRONT_PANEL2.+ FRONT_PANEL3.+ FRONT_PANEL5.+ L8.2 L12.2 L16.2 L24.2 R42.2 R64.2 R86.2 R130.2 REAR_PANEL1.+ REAR_PANEL2.+ REAR_PANEL3.+ REAR_PANEL5.+
SWO: MICROCONTROLLER1.28 MICROCONTROLLER2.28 MICROCONTROLLER3.28 MICROCONTROLLER5.28 U$16.8 U$16.9 U$24.8 U$24.9 U$32.8 U$32.9 U$48.8 U$48.9
TDI: MICROCONTROLLER1.27 MICROCONTROLLER2.27 MICROCONTROLLER3.27 MICROCONTROLLER5.27 U$16.10 U$16.11 U$24.10 U$24.11 U$32.10 U$32.11 U$48.10 U$48.11
TDO: MICROCONTROLLER1.26 MICROCONTROLLER2.26 MICROCONTROLLER3.26 MICROCONTROLLER5.26 U$16.12 U$16.13 U$24.12 U$24.13 U$32.12 U$32.13 U$48.12 U$48.13
TXD: MICROCONTROLLER1.8 MICROCONTROLLER2.8 MICROCONTROLLER3.8 MICROCONTROLLER5.8 R31.2 R53.2 R75.2 R119.2 U$16.4 U$16.5 U$24.4 U$24.5 U$32.4 U$32.5 U$48.4 U$48.5
VDDR: C30.1 C31.1 C32.1 C53.1 C54.1 C55.1 C76.1 C77.1 C78.1 C122.1 C123.1 C124.1 L5.2 L9.2 L13.2 L21.2 MICROCONTROLLER1.45 MICROCONTROLLER1.48 MICROCONTROLLER2.45 MICROCONTROLLER2.48 MICROCONTROLLER3.45 MICROCONTROLLER3.48 MICROCONTROLLER5.45 MICROCONTROLLER5.48
VDDS: C24.1 C25.1 C27.1 C28.1 C29.1 C36.1 C37.1 C38.1 C44.1 C46.1 C48.1 C49.1 C50.1 C51.1 C52.1 C59.1 C60.1 C61.1 C67.1 C69.1 C71.1 C72.1 C73.1 C74.1 C75.1 C82.1 C83.1 C84.1 C90.1 C92.1 C117.1 C118.1 C119.1 C120.1 C121.1 C128.1 C129.1 C130.1 C136.1 C138.1 GPS1.2(VCC) GPS1.18(VBAT) GPS1.58(VCC) GPS2.2(VCC) GPS2.18(VBAT) GPS2.58(VCC) GPS3.2(VCC) GPS3.18(VBAT) GPS3.58(VCC) GPS5.2(VCC) GPS5.18(VBAT) GPS5.58(VCC) IMU1.1(VDDIO) IMU1.3(VDDIO) IMU1.22(VDD) IMU1.23(VDD) IMU2.1(VDDIO) IMU2.3(VDDIO) IMU2.22(VDD) IMU2.23(VDD) IMU3.1(VDDIO) IMU3.3(VDDIO) IMU3.22(VDD) IMU3.23(VDD) IMU5.1(VDDIO) IMU5.3(VDDIO) IMU5.22(VDD) IMU5.23(VDD) LED6.A LED9.A LED12.A LED18.A LS3.C(C1) LS4.C(C1) LS5.C(C1) LS6.C(C1) LS7.C(C1) LS8.C(C1) LS11.C(C1) LS12.C(C1) MICROCONTROLLER1.13 MICROCONTROLLER1.22 MICROCONTROLLER1.34 MICROCONTROLLER1.44 MICROCONTROLLER2.13 MICROCONTROLLER2.22 MICROCONTROLLER2.34 MICROCONTROLLER2.44 MICROCONTROLLER3.13 MICROCONTROLLER3.22 MICROCONTROLLER3.34 MICROCONTROLLER3.44 MICROCONTROLLER5.13 MICROCONTROLLER5.22 MICROCONTROLLER5.34 MICROCONTROLLER5.44 R23.2 R24.2 R25.2 R28.1 R33.2 R34.1 R35.2 R45.2 R46.2 R47.2 R50.1 R55.2 R56.1 R57.2 R67.2 R68.2 R69.2 R72.1 R77.2 R78.1 R79.2 R111.2 R112.2 R113.2 R116.1 R121.2 R122.1 R123.2 U$1.VCC U$1.VM U$11.VCC U$15.1(FB) U$15.8(OUT) U$16.18 U$16.19 U$17.VCC U$17.VM U$19.VCC U$23.1(FB) U$23.8(OUT) U$24.18 U$24.19 U$25.VCC U$25.VM U$27.VCC U$31.1(FB) U$31.8(OUT) U$32.18 U$32.19 U$41.VCC U$41.VM U$43.VCC U$47.1(FB) U$47.8(OUT) U$48.18 U$48.19
X24M_N: MICROCONTROLLER1.46 MICROCONTROLLER2.46 MICROCONTROLLER3.46 MICROCONTROLLER5.46 TSX1.3 TSX2.3 TSX3.3 TSX5.3
X24M_P: MICROCONTROLLER1.47 MICROCONTROLLER2.47 MICROCONTROLLER3.47 MICROCONTROLLER5.47 TSX1.1 TSX2.1 TSX3.1 TSX5.1
Unconnected: GPS1.3(GPIO1/RXD1) GPS1.4(GPIO25/M_MISO) GPS1.5(GPIO24/M_SCK) GPS1.6(GPIO26/M_MOSI) GPS1.8(GPIO2/TXD1) GPS1.12(GPIO7/P1PPS2) GPS1.13(GPIO6/M_CSN2) GPS1.14(GPIO5/SDA) GPS1.16(GPIO23/M_CSN0) GPS1.17(NC) GPS1.20(NC) GPS1.23(NC) GPS1.26(NC) GPS1.30(NC) GPS1.34(NC) GPS1.35(NC) GPS1.36(NC) GPS1.37(GPIO4/SCL) GPS1.38(GPIO30/MS_MOSI) GPS1.39(GPIO31/MS_MISO) GPS1.40(GPIO3/P1PPS1) GPS1.41(GPIO29/MS_SCK) GPS1.43(GPIO28/MS_CSN) GPS1.45(GPIO14) GPS1.46(GPIO22) GPS1.47(GPIO9) GPS1.48(GPIO16) GPS1.50(GPIO13) GPS1.51(GPIO8) GPS1.52(GPIO27) GPS1.53(GPIO15) GPS1.54(GPIO20) GPS1.55(GPIO12) GPS1.56(NC) GPS1.57(GPIO21) GPS1.59(GPIO10) GPS1.63(GPIO11) GPS1.66(NC) GPS1.67(NC) GPS1.68(NC) GPS2.3(GPIO1/RXD1) GPS2.4(GPIO25/M_MISO) GPS2.5(GPIO24/M_SCK) GPS2.6(GPIO26/M_MOSI) GPS2.8(GPIO2/TXD1) GPS2.12(GPIO7/P1PPS2) GPS2.13(GPIO6/M_CSN2) GPS2.14(GPIO5/SDA) GPS2.16(GPIO23/M_CSN0) GPS2.17(NC) GPS2.20(NC) GPS2.23(NC) GPS2.26(NC) GPS2.30(NC) GPS2.34(NC) GPS2.35(NC) GPS2.36(NC) GPS2.37(GPIO4/SCL) GPS2.38(GPIO30/MS_MOSI) GPS2.39(GPIO31/MS_MISO) GPS2.40(GPIO3/P1PPS1) GPS2.41(GPIO29/MS_SCK) GPS2.43(GPIO28/MS_CSN) GPS2.45(GPIO14) GPS2.46(GPIO22) GPS2.47(GPIO9) GPS2.48(GPIO16) GPS2.50(GPIO13) GPS2.51(GPIO8) GPS2.52(GPIO27) GPS2.53(GPIO15) GPS2.54(GPIO20) GPS2.55(GPIO12) GPS2.56(NC) GPS2.57(GPIO21) GPS2.59(GPIO10) GPS2.63(GPIO11) GPS2.66(NC) GPS2.67(NC) GPS2.68(NC) GPS3.3(GPIO1/RXD1) GPS3.4(GPIO25/M_MISO) GPS3.5(GPIO24/M_SCK) GPS3.6(GPIO26/M_MOSI) GPS3.8(GPIO2/TXD1) GPS3.12(GPIO7/P1PPS2) GPS3.13(GPIO6/M_CSN2) GPS3.14(GPIO5/SDA) GPS3.16(GPIO23/M_CSN0) GPS3.17(NC) GPS3.20(NC) GPS3.23(NC) GPS3.26(NC) GPS3.30(NC) GPS3.34(NC) GPS3.35(NC) GPS3.36(NC) GPS3.37(GPIO4/SCL) GPS3.38(GPIO30/MS_MOSI) GPS3.39(GPIO31/MS_MISO) GPS3.40(GPIO3/P1PPS1) GPS3.41(GPIO29/MS_SCK) GPS3.43(GPIO28/MS_CSN) GPS3.45(GPIO14) GPS3.46(GPIO22) GPS3.47(GPIO9) GPS3.48(GPIO16) GPS3.50(GPIO13) GPS3.51(GPIO8) GPS3.52(GPIO27) GPS3.53(GPIO15) GPS3.54(GPIO20) GPS3.55(GPIO12) GPS3.56(NC) GPS3.57(GPIO21) GPS3.59(GPIO10) GPS3.63(GPIO11) GPS3.66(NC) GPS3.67(NC) GPS3.68(NC) GPS5.3(GPIO1/RXD1) GPS5.4(GPIO25/M_MISO) GPS5.5(GPIO24/M_SCK) GPS5.6(GPIO26/M_MOSI) GPS5.8(GPIO2/TXD1) GPS5.12(GPIO7/P1PPS2) GPS5.13(GPIO6/M_CSN2) GPS5.14(GPIO5/SDA) GPS5.16(GPIO23/M_CSN0) GPS5.17(NC) GPS5.20(NC) GPS5.23(NC) GPS5.26(NC) GPS5.30(NC) GPS5.34(NC) GPS5.35(NC) GPS5.36(NC) GPS5.37(GPIO4/SCL) GPS5.38(GPIO30/MS_MOSI) GPS5.39(GPIO31/MS_MISO) GPS5.40(GPIO3/P1PPS1) GPS5.41(GPIO29/MS_SCK) GPS5.43(GPIO28/MS_CSN) GPS5.45(GPIO14) GPS5.46(GPIO22) GPS5.47(GPIO9) GPS5.48(GPIO16) GPS5.50(GPIO13) GPS5.51(GPIO8) GPS5.52(GPIO27) GPS5.53(GPIO15) GPS5.54(GPIO20) GPS5.55(GPIO12) GPS5.56(NC) GPS5.57(GPIO21) GPS5.59(GPIO10) GPS5.63(GPIO11) GPS5.66(NC) GPS5.67(NC) GPS5.68(NC) IMU1.10(INT_M) IMU1.13(DEN_A/G) IMU2.10(INT_M) IMU2.13(DEN_A/G) IMU3.10(INT_M) IMU3.13(DEN_A/G) IMU5.10(INT_M) IMU5.13(DEN_A/G) MICROCONTROLLER1.14 MICROCONTROLLER1.15 MICROCONTROLLER1.16 MICROCONTROLLER1.17 MICROCONTROLLER1.21 MICROCONTROLLER1.29 MICROCONTROLLER1.30 MICROCONTROLLER1.31 MICROCONTROLLER1.38 MICROCONTROLLER1.39 MICROCONTROLLER1.42 MICROCONTROLLER1.43 MICROCONTROLLER2.14 MICROCONTROLLER2.15 MICROCONTROLLER2.16 MICROCONTROLLER2.17 MICROCONTROLLER2.21 MICROCONTROLLER2.29 MICROCONTROLLER2.30 MICROCONTROLLER2.31 MICROCONTROLLER2.38 MICROCONTROLLER2.39 MICROCONTROLLER2.42 MICROCONTROLLER2.43 MICROCONTROLLER3.14 MICROCONTROLLER3.15 MICROCONTROLLER3.16 MICROCONTROLLER3.17 MICROCONTROLLER3.21 MICROCONTROLLER3.29 MICROCONTROLLER3.30 MICROCONTROLLER3.31 MICROCONTROLLER3.38 MICROCONTROLLER3.39 MICROCONTROLLER3.42 MICROCONTROLLER3.43 MICROCONTROLLER5.14 MICROCONTROLLER5.15 MICROCONTROLLER5.16 MICROCONTROLLER5.17 MICROCONTROLLER5.21 MICROCONTROLLER5.29 MICROCONTROLLER5.30 MICROCONTROLLER5.31 MICROCONTROLLER5.38 MICROCONTROLLER5.39 MICROCONTROLLER5.42 MICROCONTROLLER5.43 U$10.NC U$15.2(LBI) U$15.3(LBO) U$15.4(REF) U$18.NC U$23.2(LBI) U$23.3(LBO) U$23.4(REF) U$26.NC U$31.2(LBI) U$31.3(LBO) U$31.4(REF) U$42.NC U$47.2(LBI) U$47.3(LBO) U$47.4(REF)

## Notes on the sheet
- Consider less resistance | Consider less resistance
- Inertial Measurement Unit
- Torque
  Coil
  Driver
- Inertial Measurement Unit
- Torque
  Coil
  Driver
- Light
  Sensors
- Pin
  Breakouts
- Light
  Sensors
- Pin
  Breakouts
- CDH/T&C | CDH/T&C
- Global
  Positioning
  System
- Global
  Positioning
  System
- Power
  Management
- Power
  Management
- Consider less resistance | Consider less resistance
- Inertial Measurement Unit
- Torque
  Coil
  Driver
- Inertial Measurement Unit
- Torque
  Coil
  Driver
- Light
  Sensors
- Pin
  Breakouts
- Light
  Sensors
- Pin
  Breakouts
- CDH/T&C | CDH/T&C
- Global
  Positioning
  System
- Global
  Positioning
  System
- Power
  Management
- Power
  Management

## Library data of the parts
32.1-32.3 32.5 = FC-135:FC-135: FC-135 32.768KA-AG0
BALUN1-BALUN3 BALUN5 = JOHANSON_BALUN:JOHANSON_BALUN
C21 C24 C25 C27-C92 C116-C138 = SparkFun:CAP: Capacitor Standard 0603 ceramic capacitor, and 0.1" leaded capacitor.
FRONT_PANEL1-FRONT_PANEL3 FRONT_PANEL5 REAR_PANEL1-REAR_PANEL3 REAR_PANEL5 = ALTA_CELL:ALTA_CELL
GPS1-GPS3 GPS5 = VENUS838FLPX:VENUS838FLPX: Venus838FLPx-L
IMU1-IMU3 IMU5 = SparkFun-Sensors:LSM9DS1: LSM9DS1 3D accelerometer, gyroscope & magnetometer The LSM9DS1 is a system-in-package featuring a 3D digital linear acceleration sensor, a 3D digital angular rate sensor, and a 3D digital magnetic sensor. The LSM9DS1 has a linear acceleration full scale of ±2g/±4g/±8/±16 g, a magnetic field full scale of ±4/±8/±12/±16 gauss and an angular rate of ±245/±500/±2000 dps. The LSM9DS1 includes an I2 C serial bus interface supporting standard and fast mode (100 kHz and 400 kHz) and an SPI serial standard interface. Magnetic, accelerometer and gyroscope sensing can be enabled or set in power-down mode separately for smart power management. The LSM9DS1 is available in a plastic land grid array package (LGA) and it is guaranteed to operate over an extended temperature range from -40 °C to +85 °C.; PROD_ID: IC-12536
L5-L16 L21-L24 = SparkFun:INDUCTOR: Inductors Basic Inductor/Choke - 0603 and 1206. Footprints are not proven and vary greatly between part numbers.
LED4-LED12 LED16-LED18 = SparkFun:LED: LEDs Standard schematic elements and footprints for 5mm, 3mm, 1206, and 0603 sized LEDs. 5mm - Spark Fun Electronics SKU : COM-00529 (and others)
LS3-LS8 LS11 LS12 = SparkFun-Sensors:LIGHTSENSOR: Ambient Light Sensor Simple light detection sensor. Output varies with light intensity input. Spark Fun Electronics SKU : COM-08348; PROD_ID: IC-11836
MICROCONTROLLER1-MICROCONTROLLER3 MICROCONTROLLER5 = CC1310RGZ48:CC1310: CC1310 RGZ48 package
R23-R88 R111-R132 = SparkFun:RESISTOR: Resistor Basic schematic elements and footprints for 0603, 1206, and PTH resistors.
TSX1-TSX3 TSX5 = TSX-3225:TSX-3225
U$1 U$17 U$25 U$41 = LV8417CS:LV8417CS
U$10 U$18 U$26 U$42 = johanson_gps_chip:JOHANSON_GPS_CHIP
U$11 U$19 U$27 U$43 = Panasonic_Rectifier:PANASONIC_RECTIFIER
U$12 U$20 U$28 U$44 = PCB_ANTENNA:PCB_ANTENNA
U$13 U$14 U$21 U$22 U$29 U$30 U$45 U$46 = MM5329-2700:MM5329-2700
U$15 U$23 U$31 U$47 = L6920:L6920
U$16 U$24 U$32 U$48 = HDMID:HDMID